# EAGLE design voltage regualtor (EAGLE 9.6.2)
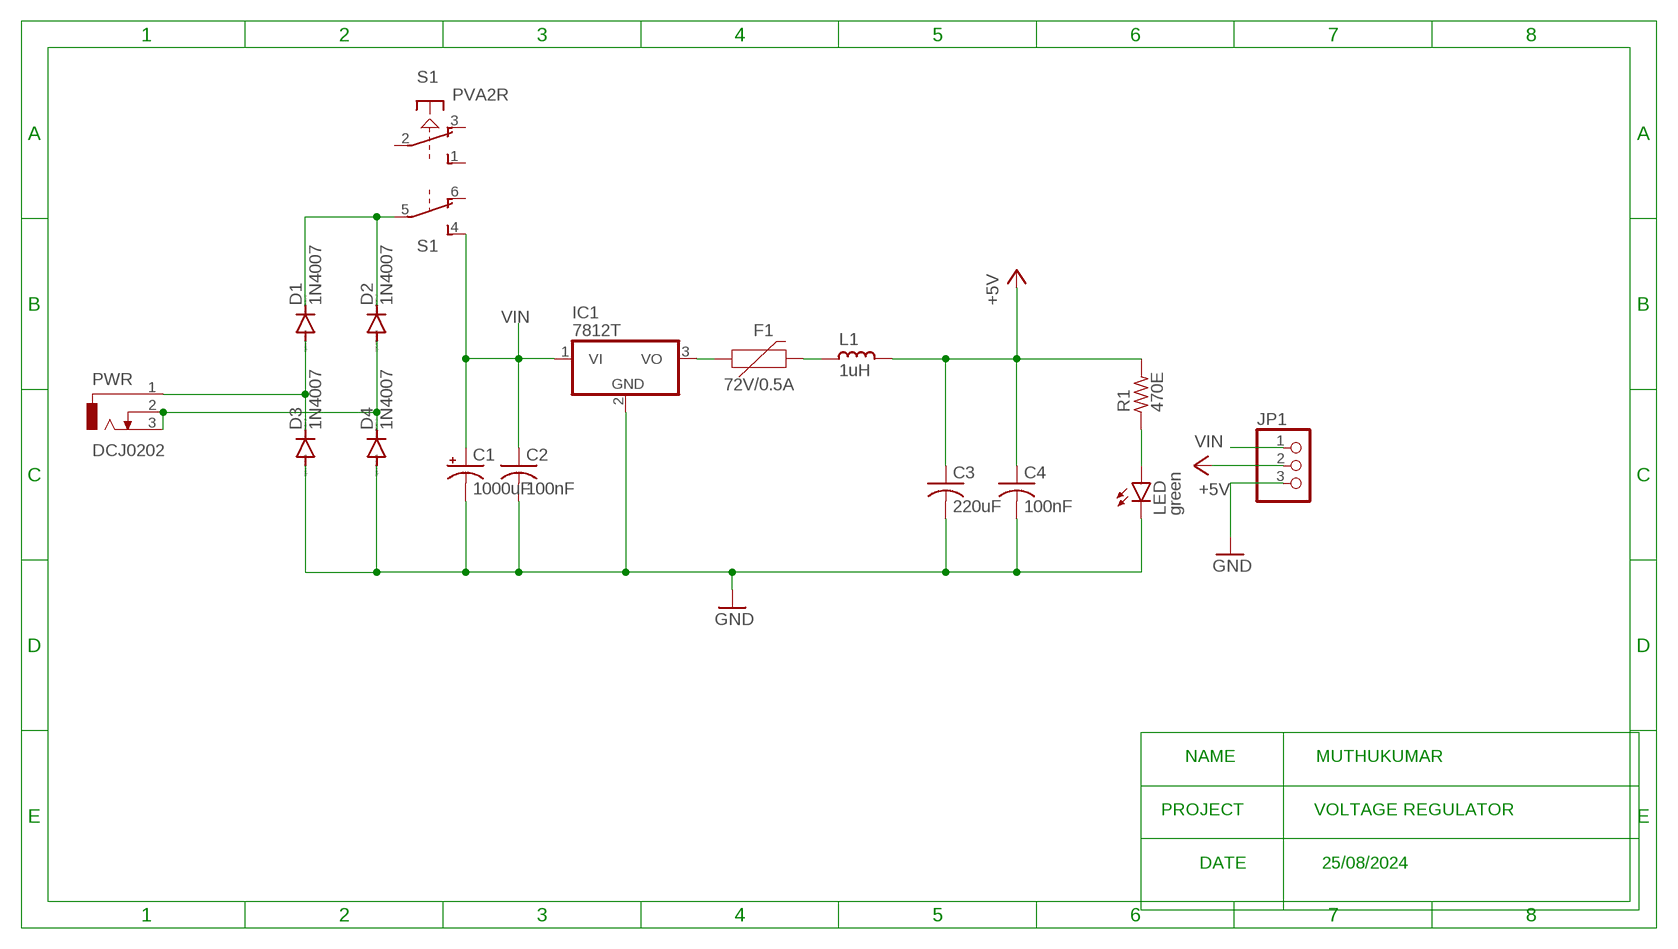
[diagram p0: schematic, sheet 1]

## Parts
C1  1000uF  CPOL-USE5-13  [E5-13]
C2  100nF  C-USC0805  [C0805]
C3  220uF  C-USC0805  [C0805]
C4  100nF  C-USC0805  [C0805]
D1  1N4007  1N4004  [DO41-10]
D2  1N4007  1N4004  [DO41-10]
D3  1N4007  1N4004  [DO41-10]
D4  1N4007  1N4004  [DO41-10]
F1  72V/0.5A  PPTC_PTH  [PTH]
IC1  7812T  [TO220H]
JP1  PINHD-1X3  [1X03]
L1  1uH  L_0805  [L0805]
LED  green  LEDCHIPLED_0805  [CHIPLED_0805]
PWR  DCJ0202  [DCJ0202]
R1  470E  R_0805  [R0805]
S1  PVA2R  [PVA2R]

## Nets
+5V: C3.1 C4.1 JP1.2 L1.1 R1.2
GND: C1.- C2.2 C3.2 C4.2 D3.A D4.A IC1.2(GND) JP1.3 LED.C
N$1: D1.C D2.C S1.5(2:P)
N$2: D1.A D3.C PWR.1
N$5: D2.A D4.C PWR.2 PWR.3
N$6: F1.P$1 IC1.3(VO)
N$7: F1.P$2 L1.2
N$9: LED.A R1.1
VIN: C1.+ C2.1 IC1.1(VI) JP1.1 S1.4(2:S)
Unconnected: S1.1(1:S) S1.2(1:P) S1.3(1:O) S1.6(2:O)

## Notes on the sheet
- NAME                MUTHUKUMAR
- PROJECT              VOLTAGE REGULATOR
- DATE               25/08/2024

## Library data of the parts
C1 = rcl:CPOL-US: POLARIZED CAPACITOR, American symbol; SPICEPREFIX: C
C2-C4 = rcl:C-US: CAPACITOR, American symbol; SPICEPREFIX: C
D1-D4 = diode:1N4004: DIODE general purpose rectifier, 1 A
F1 = SparkFun-Fuses:PPTC: Resettable Fuse PPTC Resettable Fuse. Really a sort of resistor with a polymeric positive temperature coefficient whose resistance increases dramatically with an increase in temperature. When heated by the power passing through the resistance rises causing the current to be limited, protecting the circuit. This is achieved by the transition of the polymer from a crystalline to an amorphous state where the conductive carbon separates breaking the conductive pathways found in the cool crystalline structure. When a PPTC cools back down it resumes conducting letting the circuit turn back on. SparkFun Products: SparkFun RedBoard - Programmed with Arduino <https://www.sparkfun.com/products/12757> Pro Micro - 5V/16MHz <https://www.sparkfun.com/products/12640> Arduino Pro 328 - 5V/16MHz <https://www.sparkfun.com/products/10915> MP3 Trigger <https://www.sparkfun.com/products/13720>; PROD_ID: RES-08490; VALUE: 72V/0.25A
IC1 = linear:78*: Positive VOLTAGE REGULATOR Source: http://cache.national.com/ds/LM/LM78L05.pdf http://www.fairchildsemi.com/ds/LM/LM7805.pdf
JP1 = pinhead:PINHD-1X3: PIN HEADER
L1 = rc-master-smd:L_: INDUCTOR
LED = led:LED: LED OSRAM: - CHIPLED LG R971, LG N971, LY N971, LG Q971, LY Q971, LO R971, LY R971 LH N974, LH R974 LS Q976, LO Q976, LY Q976 LO Q996 - Hyper CHIPLED LW Q18S LB Q993, LB Q99A, LB R99A - SideLED LS A670, LO A670, LY A670, LG A670, LP A670 LB A673, LV A673, LT A673, LW A673 LH A674 LY A675 LS A676, LA A676, LO A676, LY A676, LW A676 LS A679, LY A679, LG A679 - Hyper Micro SIDELED® LS Y876, LA Y876, LO Y876, LY Y876 LT Y87S - SmartLED LW L88C, LW L88S LB L89C, LB L89S, LG L890 LS L89K, LO L89K, LY L89K LS L896, LA L896, LO L896, LY L896 - TOPLED LS T670, LO T670, LY T670, LG T670, LP T670 LSG T670, LSP T670, LSY T670, LOP T670, LYG T670 LG T671, LOG T671, LSG T671 LB T673, LV T673, LT T673, LW T673 LH T674 LS T676, LA T676, LO T676, LY T676, LB T676, LH T676, LSB T676, LW T676 LB T67C, LV T67C, LT T67C, LS T67K, LO T67K, LY T67K, LW E67C LS E67B, LA E67B, LO E67B, LY E67B, LB E67C, LV E67C, LT E67C LW T67C LS T679, LY T679, LG T679 LS T770, LO T770, LY T770, LG T770, LP T770 LB T773, LV T773, LT T773, LW T773 LH T774 LS E675, LA E675, LY E675, LS T675 LS T776, LA T776, LO T776, LY T776, LB T776 LHGB T686 LT T68C, LB T68C - Hyper Mini TOPLED® LB M676 - Mini TOPLED Santana® LG M470 LS M47K, LO M47K, LY M47K Source: http://www.osram.convergy.de LUXEON: - LUMILED® LXK2-PW12-R00, LXK2-PW12-S00, LXK2-PW14-U00, LXK2-PW14-V00 LXK2-PM12-R00, LXK2-PM12-S00, LXK2-PM14-U00 LXK2-PE12-Q00, LXK2-PE12-R00, LXK2-PE12-S00, LXK2-PE14-T00, LXK2-PE14-U00 LXK2-PB12-K00, LXK2-PB12-L00, LXK2-PB12-M00, LXK2-PB14-N00, LXK2-PB14-P00, LXK2-PB14-Q00 LXK2-PR12-L00, LXK2-PR12-M00, LXK2-PR14-Q00, LXK2-PR14-R00 LXK2-PD12-Q00, LXK2-PD12-R00, LXK2-PD12-S00 LXK2-PH12-R00, LXK2-PH12-S00 LXK2-PL12-P00, LXK2-PL12-Q00, LXK2-PL12-R00 Source: www.luxeon.com KINGBRIGHT: KA-3528ASYC Source: www.kingbright.com
PWR = con-jack:DCJ0202: DC POWER JACK Source: DCJ0202.pdf; OC_FARNELL: unknown; OC_NEWARK: unknown
R1 = rc-master-smd:R_: RESISTOR
S1 = switch-misc:PVA2R: ITT SWITCH

## Board
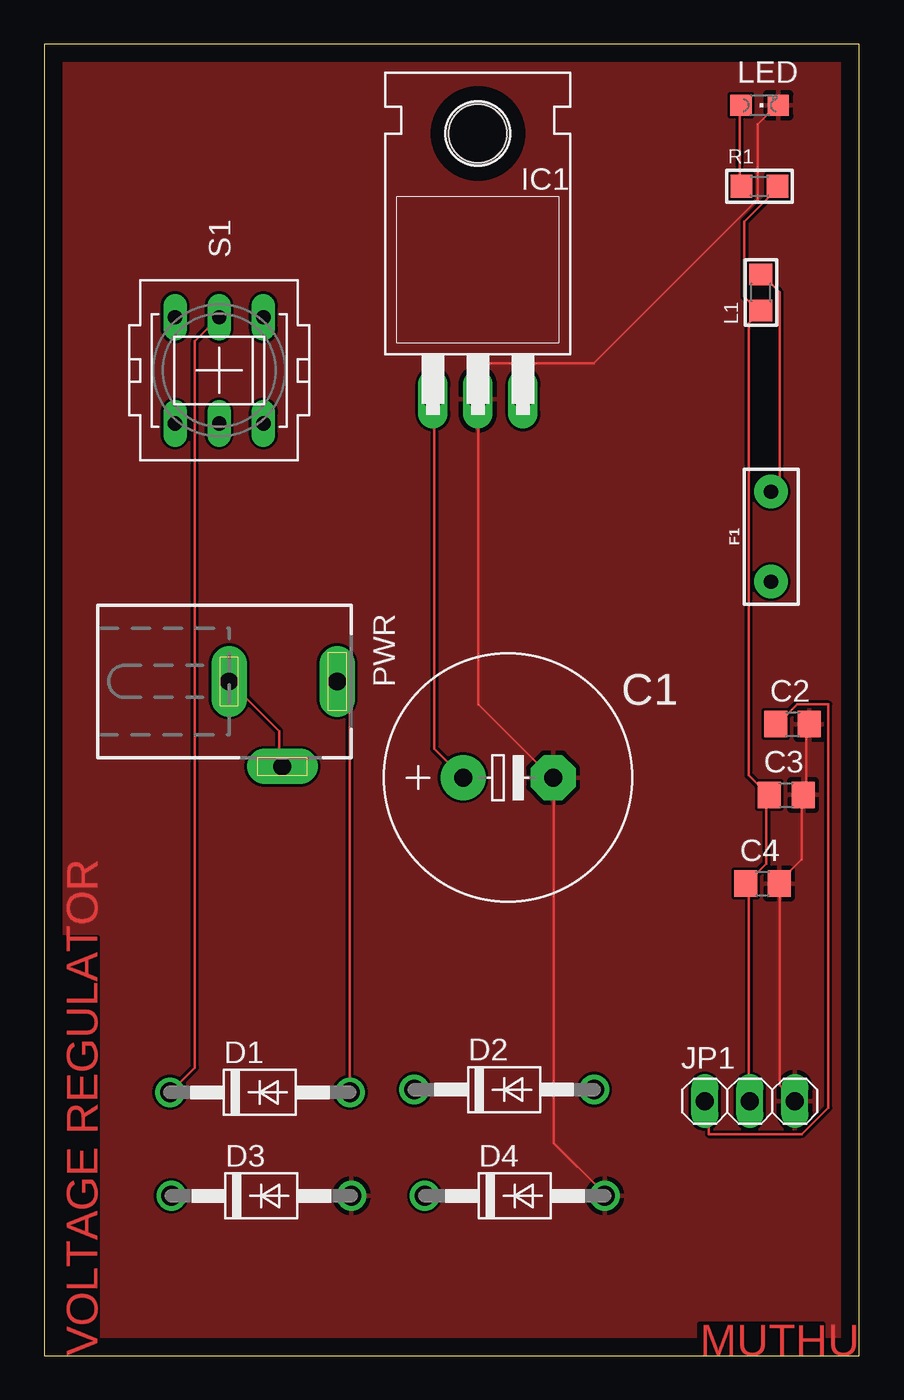
[diagram p1: board, top side]
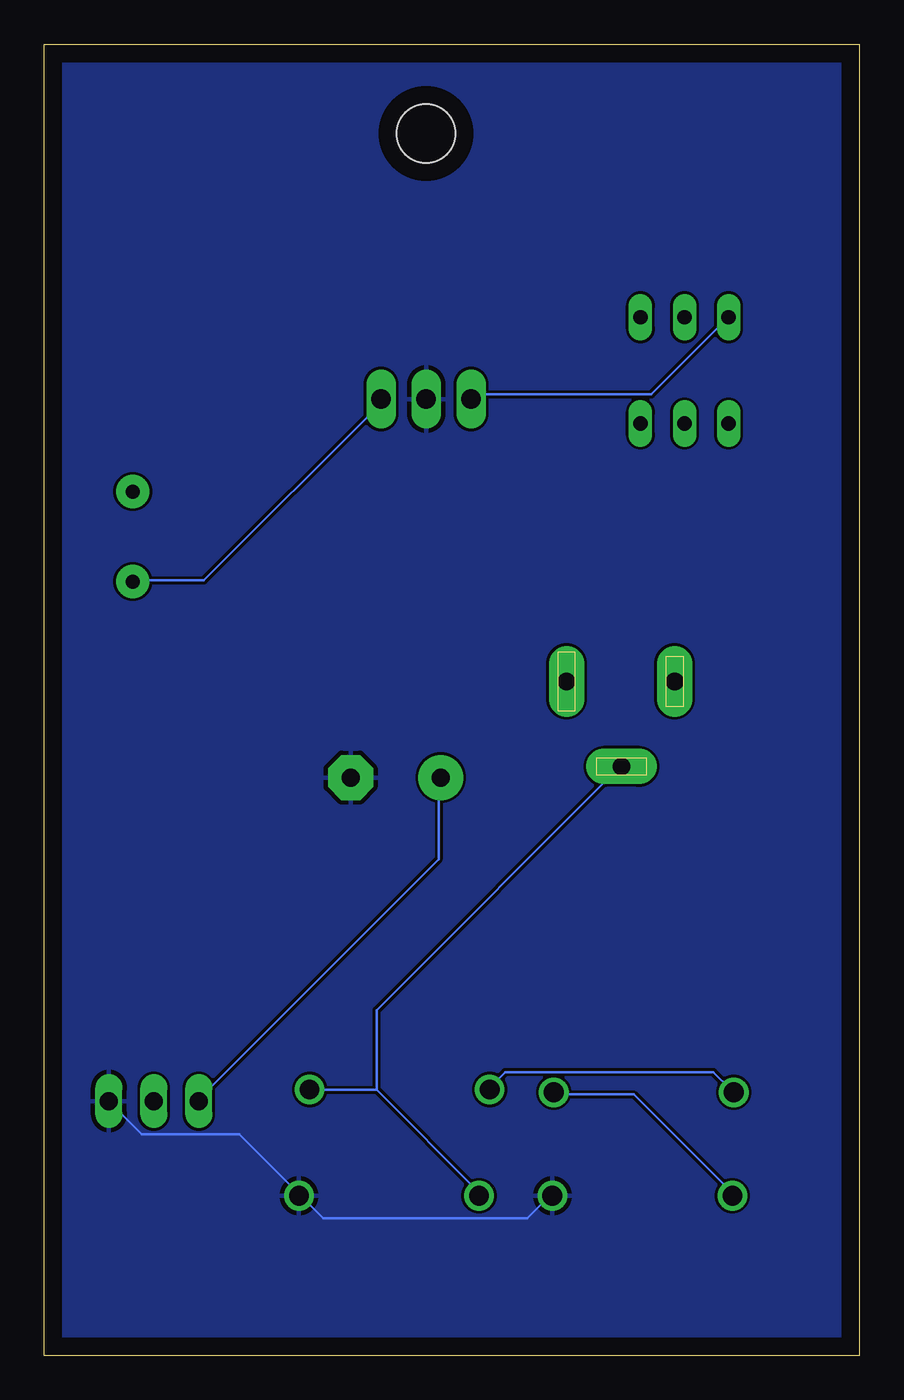
[diagram p2: board, bottom side, seen from below]

Size 46 x 74 mm. Coordinates in mm from the lower left corner, seen from the top.
Outline: 0,0 46,0 46,74 0,74 0,0
Copper layers (1*16): Top 0.035mm / dielectric 1.5mm / Bottom 0.035mm
Design rules "default": minimum track width 6mil, minimum drill 0.35mm, track to track 6mil, track to pad 6mil, pad to pad 6mil, via to via 6mil, smd to smd 6mil, copper to edge 40mil, drill to drill 6mil, minimum pad ring 10mil, minimum via ring 8mil, stop-mask expansion 4mil, vias tented up to drill 0mil, thermal gap 10mil

### Footprints (pad centres in the part's own frame; a part is rotated, then mirrored left to right if it is on the bottom)
E5-13 = drill 1.016 pad 2.54: + -2.54,0 | drill 1.016 pad 2.54 octagon: - 2.54,0
C0805 = smd 1.3 x 1.5: 1 -0.95,0; 2 0.95,0
DO41-10 = drill 1.118: A 5.08,0; C -5.08,0
PTH = drill 0.8 pad 1.88: P$1 -2.54,0; P$2 2.54,0
TO220H = drill 1.118 long: 1 -2.54,-10.16; 2 0,-10.16; 3 2.54,-10.16 | hole 3.302: 0,4.826
1X03 = drill 1.016 long: 1 -2.54,0; 2 0,0; 3 2.54,0
L0805 = smd 1.2 x 1.3: 1 -1.016,0; 2 1.016,0
CHIPLED_0805 = smd 1.2 x 1.2: A 0,-1.05; C 0,1.05
DCJ0202 = drill 1 pad 2 long: 1 0,3.1; 2 4.8,0; 3 0,-3
R0805 = smd 1.2 x 1.3: 1 -1.016,0; 2 1.016,0
PVA2R = drill 0.813 long: 1 -2.997,2.489; 2 -2.997,0; 3 -2.997,-2.489; 4 2.997,2.489; 5 2.997,0; 6 2.997,-2.489

### Placement (x,y rotation side)
C1  26.17,32.62 0 top
C2  42.22,35.64 0 top
C3  41.87,31.64 0 top
C4  40.52,26.64 0 top
D1  12.17,14.86 0 top
D2  25.95,15.02 0 top
D3  12.25,9.02 0 top
D4  26.55,9.02 0 top
F1  41.01,46.22 90 top
IC1  24.46,64.14 0 top
JP1  39.82,14.37 0 top
L1  40.44,59.99 90 top
LED  40.37,70.56 270 top
PWR  13.43,38.05 270 top
R1  40.36,65.99 0 top
S1  9.87,55.6 90 top

### Tracks (layer width: path | path; a pad name or v marks a point on that pad's centre or on a via)
+5V
  Top 0.152: R1.2 41.25,65.75 39.5,64 39.5,59.75 40.25,59 L1.1 40.25,58.75 39.75,58.25 39.75,32.75 40.75,31.75 C3.1 40.75,31.5 40.75,27.75 39.75,26.75 C4.1 39.75,26.5 39.75,14.5 JP1.2
GND
  Top 0.152: C2.2 43,35.5 43,31.75 C3.2 42.75,31.5 42.75,28 41.5,26.75 C4.2 41.5,26.5 41.5,15.25 42.25,14.5 JP1.3 | LED.C 41.25,70.5 40.25,69.5 40.25,65.25 31,56 24.5,56 24.5,54 IC1.2 24.5,53.75 24.5,36.75 28.5,32.75 C1.- 28.75,32.5 28.75,12 31.5,9.25 D4.A
  Bottom 0.152: D3.A 17.5,9 18.75,7.75 30.25,7.75 31.5,9 D4.A 31.75,9.25 35,12.5 40.5,12.5 42.25,14.25 JP1.3
  pour Top: 0,74 0,0 46,0 46,74
  pour Bottom: 0,74 46,74 46,0 0,0
N$1
  Top 0.152: S1.5 9.75,58.5 8.5,57.25 8.5,16.25 7.25,15 D1.C
  Bottom 0.152: D2.C 20.75,15.25 20,16 8.25,16 7.25,15 D1.C
N$2
  Top 0.152: D1.A 17.25,37.5 16.75,38 PWR.1
  Bottom 0.152: D3.C 7.25,9.25 12.75,14.75 17.25,14.75 D1.A
N$5
  Top 0.152: PWR.3 10.5,38 13.25,35.25 13.25,33.25 PWR.2
  Bottom 0.152: 27.25,15 21.5,9.25 D4.C | 27.25,15 31,15 D2.A | 27.25,15 27.25,19.5 13.5,33.25 PWR.2
N$6
  Bottom 0.152: IC1.3 27,53.75 37,43.75 41,43.75 F1.P$1
N$7
  Top 0.152: F1.P$2 41.5,49.25 41.5,60 40.5,61 L1.2
N$9
  Top 0.152: LED.A 39.25,70.5 39.25,66 R1.1
VIN
  Top 0.152: C2.1 41.5,35.75 42.5,36.75 44.25,36.75 44.25,14 42.75,12.5 37.5,12.5 37.5,14.25 JP1.1 | C1.+ 22,34.25 22,53.75 IC1.1
  Bottom 0.152: S1.4 7.5,58.5 11.75,54.25 21.5,54.25 21.75,54 IC1.1 | JP1.1 37.25,14.5 23.75,28 23.75,32.5 C1.+

### Text on the board
Top: VOLTAGE REGULATOR | MUTHU